# Altium schematic sheet 19V_Converter.SchDoc
size A
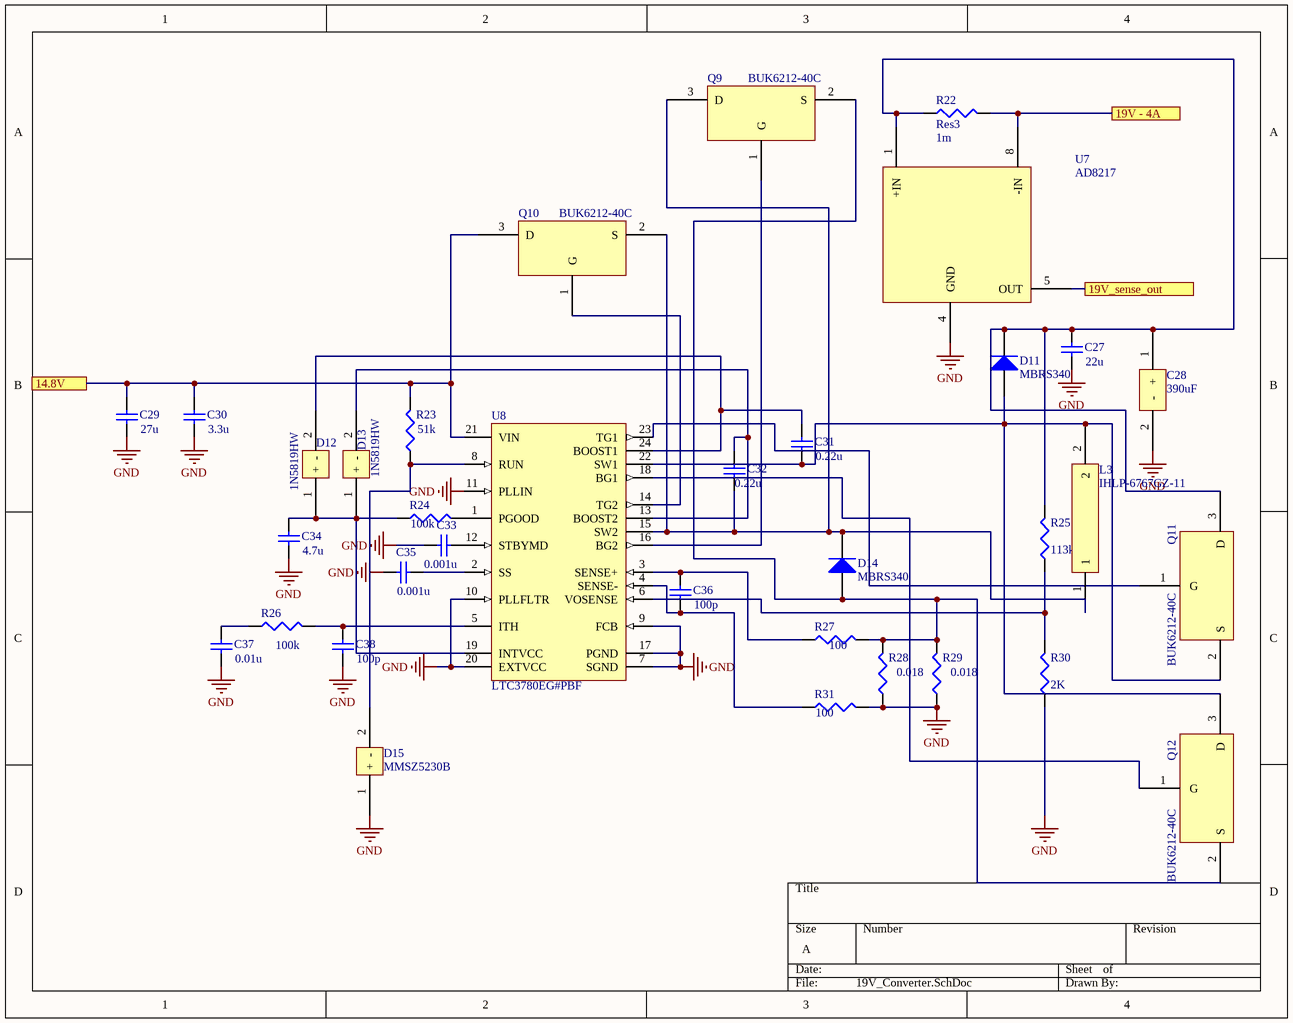
[diagram p0: 19V_Converter.SchDoc]

## Parts
C27  value 22u  [C1206]  (hidden comment: Cap Semi)
C28  390uF  [PCV1E391MCL2GS]
C29  value 27u  [C1206]  (hidden comment: Cap Semi)
C30  value 3.3u  [C1206]  (hidden comment: Cap Semi)
C31  value 0.22u  [C1206]  (hidden comment: Cap Semi)
C32  value 0.22u  [C1206]  (hidden comment: Cap Semi)
C33  value 0.001u  [C1206]  (hidden comment: Cap Semi)
C34  value 4.7u  [C1206]  (hidden comment: Cap Semi)
C35  value 0.001u  [C1206]  (hidden comment: Cap Semi)
C36  value 100p  [C1206]  (hidden comment: Cap Semi)
C37  value 0.01u  [C1206]  (hidden comment: Cap Semi)
C38  value 100p  [C1206]  (hidden comment: Cap Semi)
D11  MBRS340  [SMC]
D12  1N5819HW  [1N5819HW]
D13  1N5819HW  [1N5819HW]
D14  MBRS340  [SMC]
D15  MMSZ5230B  [MMSZ5230B]
L3  IHLP-6767GZ-11  [IHLP-6767GZ-11]
Q9  BUK6212-40C  [BUK6212-40C]
Q10  BUK6212-40C  [BUK6212-40C]
Q11  BUK6212-40C  [BUK6212-40C]
Q12  BUK6212-40C  [BUK6212-40C]
R22  Res3  value 1m  [14-1210]
R23  value 51k  [J1-0603]  (hidden comment: Res3)
R24  value 100k  [J1-0603]  (hidden comment: Res3)
R25  value 113k  [J1-0603]  (hidden comment: Res3)
R26  value 100k  [J1-0603]  (hidden comment: Res3)
R27  value 100  [J1-0603]  (hidden comment: Res3)
R28  value 0.018  [14-1210]  (hidden comment: Res3)
R29  value 0.018  [14-1210]  (hidden comment: Res3)
R30  value 2K  [J1-0603]  (hidden comment: Res3)
R31  value 100  [J1-0603]  (hidden comment: Res3)
U7  AD8217  [AD8217]
U8  LTC3780EG#PBF  [LTC3780 24-Leaqd Plastic SSOP]

## Ports
14.8V, 19V - 4A, 19V_sense_out

## Nets
GND: C27.1 C28.2(-) C29.1 C30.1 C33.1 C34.1 C35.1 C37.1 C38.1 D15.1(+) R28.1 R29.1 R30.1 R31.2 U7.4(GND) U8.7(SGND) U8.9(FCB) U8.10(PLLFLTR) U8.11(PLLIN) U8.17(PGND) U8.20(EXTVCC)
14.8V: C29.2 C30.2 Q10.3(D) R23.2 U8.21(VIN) ; port 14.8V
19V - 4A: R22.2 U7.8(-IN) ; port 19V - 4A
19V_sense_out: U7.5(OUT) ; port 19V_sense_out
NetC27_2: C27.2 C28.1(+) D11.2(K) Q11.3(D) R22.1 R25.2 U7.1(+IN)
NetC31_1: C31.1 D11.1(A) L3.2 Q11.2(S) Q12.3(D) U8.22(SW1)
NetC31_2: C31.2 D12.2(-) U8.24(BOOST1)
NetC32_1: C32.1 D14.2(K) L3.1 Q9.3(D) Q10.2(S) U8.15(SW2)
NetC32_2: C32.2 D13.2(-) U8.13(BOOST2)
NetC33_2: C33.2 U8.12(STBYMD)
NetC34_2: C34.2 D12.1(+) D13.1(+) R24.1 U8.19(INTVCC)
NetC35_2: C35.2 U8.2(SS)
NetC36_1: C36.1 R31.1 U8.4(SENSE-)
NetC36_2: C36.2 R27.1 U8.3(SENSE+)
NetC37_2: C37.2 R26.1
NetC38_2: C38.2 R26.2 U8.5(ITH)
NetD14_1: D14.1(A) Q9.2(S) Q12.2(S) R27.2 R28.2 R29.2
NetD15_2: D15.2(-) R23.1 U8.8(RUN)
NetQ9_1: Q9.1(G) U8.16(BG2)
NetQ10_1: Q10.1(G) U8.14(TG2)
NetQ11_1: Q11.1(G) U8.23(TG1)
NetQ12_1: Q12.1(G) U8.18(BG1)
NetR24_2: R24.2 U8.1(PGOOD)
NetR25_1: R25.1 R30.2 U8.6(VOSENSE)

## Library data of the parts
C27 C29-C38 = Cap Semi: Capacitor (Semiconductor SIM Model); Published: 8-Jun-2000; LatestRevisionDate: 29-May-2009; LatestRevisionNote: IPC-7351 Footprint Added.; PackageReference: C1206; Publisher: Altium Limited; PackageDescription: Chip Capacitor
C28 = PCV1E391MCL2GS: Aluminum Capacitor
D11 D14 = Diode: Default Diode; Published: 8-Jun-2000; LatestRevisionDate: 17-Jul-2002; LatestRevisionNote: Re-released for DXP Platform.; PackageVersion: Sep-1996; PackageReference: SMC; Publisher: Altium Limited; PackageDescription: DO-214-AB/SMC; 2 C-Bend Leads; Body 7.9 x 5.9 mm, inc. leads (LxW); Code_JEDEC: DO-214-AB
D12 D13 = 1N5819HW: 1A Schottky Barrier Rectifier
D15 = MMSZ5230B: Zener Diode
L3 = IHLP-6767GZ-11: Inductor
Q9-Q12 = BUK6212-40C: N-Channel TrenchMOS Intermediate Level FET
R22-R31 = Res3: Resistor; Published: 8-Jun-2000; LatestRevisionDate: 29-May-2009; LatestRevisionNote: IPC-7351 Footprint Added.; PackageReference: J1-0603; Publisher: Altium Limited; PackageDescription: Chip Resistor
U7 = AD8217: Current Shunt Moniter
U8 = LTC3780EG#PBF: Buck-boost Controller, Constant Frequency, Current Mode Control with Power Good Output, 24-pin SOP (G-24), -40 to 85 degC, Pb-Free; Manufacturer: Linear Technology; Frequency Sync Range: 200kHz - 400kHz; Number of Outputs: 1; PackageDesciption: 24-Pin Plastic SSOP, Body 8.2 x 5.3 mm, Pitch 0.65 mm; ComponentLink1Description: Manufacturer URL; ComponentLink1URL: http://www.linear.com/; ComponentLink2Description: Datasheet; ComponentLink2URL: http://cds.linear.com/docs/en/datasheet/3780ff.pdf; ComponentLink3Description: Package Specification; ComponentLink3URL: http://cds.linear.com/docs/en/packaging/SSOP_24_05-08-1640.pdf; DatasheetVersion: Rev. F; Mounting Technology: Surface Mount; PackageReference: G-24; PackageVersion: Jun-10; PartNumber: LTC3780EG#PBF; RoHS: TRUE; Supplier 1: Digi-Key; Supplier 2: Farnell; Supplier 3: Newark; Supplier Part Number 1: LTC3780EG#PBF-ND; Supplier Part Number 2: 1273545; Supplier Part Number 3: 56M8395